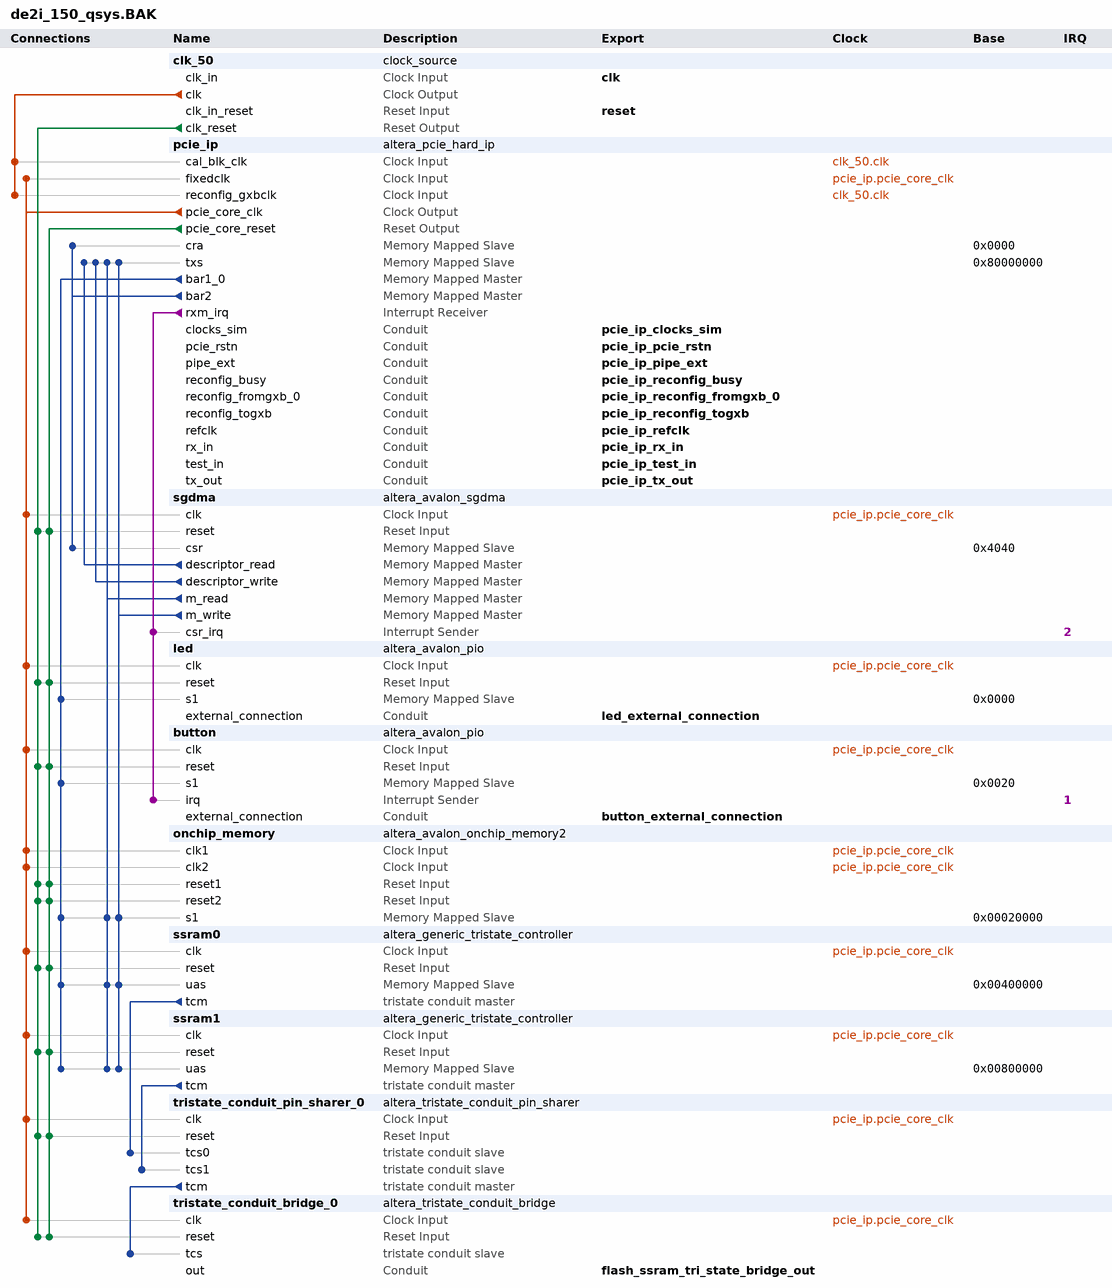
[diagram p0: system contents]
# Platform Designer (Qsys) system de2i_150_qsys.BAK, Cyclone IV GX EP4CGX150DF31C7
# Parameters at their usual value, and those the tool derives, are not listed.
package require -exact qsys 13.1
create_system de2i_150_qsys.BAK
set_project_property DEVICE_FAMILY {Cyclone IV GX}
set_project_property DEVICE EP4CGX150DF31C7

add_instance clk_50 clock_source 13.1
set_instance_parameter_value clk_50 clockFrequency 50000000

add_instance pcie_ip altera_pcie_hard_ip 13.1
set_instance_parameter_value pcie_ip p_pcie_test_out_width None
set_instance_parameter_value pcie_ip {BAR Type} {64 bit Prefetchable,Not used,32 bit Non-Prefetchable,Not used,Not used,Not used}
set_instance_parameter_value pcie_ip vendor_id 4466
set_instance_parameter_value pcie_ip device_id 57345
set_instance_parameter_value pcie_ip class_code 0
set_instance_parameter_value pcie_ip subsystem_vendor_id 4466
set_instance_parameter_value pcie_ip subsystem_device_id 4
set_instance_parameter_value pcie_ip my_advanced_errors false
set_instance_parameter_value pcie_ip my_enable_ecrc_check false
set_instance_parameter_value pcie_ip my_enable_ecrc_gen false
set_instance_parameter_value pcie_ip CG_NO_CPL_REORDERING 0
set_instance_parameter_value pcie_ip CG_ENABLE_A2P_INTERRUPT 0
set_instance_parameter_value pcie_ip p_user_msi_enable 0
set_instance_parameter_value pcie_ip CB_A2P_ADDR_MAP_PASS_THRU_BITS 31
set_instance_parameter_value pcie_ip {PCIe Address 63:32} 0x00000000,0x00000000,0x00000000,0x00000000,0x00000000,0x00000000,0x00000000,0x00000000,0x00000000,0x00000000,0x00000000,0x00000000,0x00000000,0x00000000,0x00000000,0x00000000
set_instance_parameter_value pcie_ip {PCIe Address 31:0} 0x00000000,0x00000000,0x00000000,0x00000000,0x00000000,0x00000000,0x00000000,0x00000000,0x00000000,0x00000000,0x00000000,0x00000000,0x00000000,0x00000000,0x00000000,0x00000000

add_instance sgdma altera_avalon_sgdma 13.1
set_instance_parameter_value sgdma enableBurstTransfers false
set_instance_parameter_value sgdma enableUnalignedTransfers false
set_instance_parameter_value sgdma readBlockDataWidth 64
set_instance_parameter_value sgdma sinkErrorWidth 0
set_instance_parameter_value sgdma sourceErrorWidth 0
set_instance_parameter_value sgdma transferMode MEMORY_TO_MEMORY
set_instance_parameter_value sgdma writeBurstcountWidth 4

add_instance led altera_avalon_pio 13.1
set_instance_parameter_value led direction Output
set_instance_parameter_value led width 4

add_instance button altera_avalon_pio 13.1
set_instance_parameter_value button captureEdge true
set_instance_parameter_value button direction Input
set_instance_parameter_value button edgeType FALLING
set_instance_parameter_value button generateIRQ true
set_instance_parameter_value button irqType EDGE
set_instance_parameter_value button width 4

add_instance onchip_memory altera_avalon_onchip_memory2 13.1
set_instance_parameter_value onchip_memory dataWidth 64
set_instance_parameter_value onchip_memory dualPort true
set_instance_parameter_value onchip_memory initMemContent true
set_instance_parameter_value onchip_memory initializationFileName onchip_memory
set_instance_parameter_value onchip_memory memorySize 131072

add_instance ssram0 altera_generic_tristate_controller 13.1
set_instance_parameter_value ssram0 TCM_ADDRESS_W 22
set_instance_parameter_value ssram0 TCM_DATA_W 32
set_instance_parameter_value ssram0 TCM_BYTEENABLE_W 4
set_instance_parameter_value ssram0 TCM_READ_WAIT 0
set_instance_parameter_value ssram0 TCM_WRITE_WAIT 0
set_instance_parameter_value ssram0 TCM_SETUP_WAIT 0
set_instance_parameter_value ssram0 TCM_DATA_HOLD 0
set_instance_parameter_value ssram0 TCM_MAX_PENDING_READ_TRANSACTIONS 5
set_instance_parameter_value ssram0 TCM_TURNAROUND_TIME 2
set_instance_parameter_value ssram0 TCM_TIMING_UNITS 1
set_instance_parameter_value ssram0 TCM_READLATENCY 4
set_instance_parameter_value ssram0 TCM_SYMBOLS_PER_WORD 4
set_instance_parameter_value ssram0 USE_READ 0
set_instance_parameter_value ssram0 USE_BEGINTRANSFER 1
set_instance_parameter_value ssram0 USE_BYTEENABLE 1
set_instance_parameter_value ssram0 USE_OUTPUTENABLE 1
set_instance_parameter_value ssram0 ACTIVE_LOW_READ 0
set_instance_parameter_value ssram0 ACTIVE_LOW_BYTEENABLE 1
set_instance_parameter_value ssram0 ACTIVE_LOW_OUTPUTENABLE 1
set_instance_parameter_value ssram0 ACTIVE_LOW_BEGINTRANSFER 1
set_instance_parameter_value ssram0 CHIPSELECT_THROUGH_READLATENCY 1
set_instance_parameter_value ssram0 MODULE_ASSIGNMENT_KEYS embeddedsw.configuration.hwClassnameDriverSupportList,embeddedsw.CMacro.SRAM_MEMORY_SIZE,embeddedsw.CMacro.SRAM_MEMORY_UNITS,embeddedsw.CMacro.SSRAM_DATA_WIDTH,embeddedsw.CMacro.SSRAM_READ_LATENCY,embeddedsw.memoryInfo.MEM_INIT_DATA_WIDTH,embeddedsw.memoryInfo.HAS_BYTE_LANE,embeddedsw.memoryInfo.GENERATE_DAT_SYM,embeddedsw.memoryInfo.DAT_SYM_INSTALL_DIR
set_instance_parameter_value ssram0 MODULE_ASSIGNMENT_VALUES altera_avalon_lan91c111:altera_avalon_cfi_flash,2,4194304,32,2,32,1,1,SIM_DIR
set_instance_parameter_value ssram0 INTERFACE_ASSIGNMENT_KEYS embeddedsw.configuration.isMemoryDevice
set_instance_parameter_value ssram0 INTERFACE_ASSIGNMENT_VALUES 1

add_instance ssram1 altera_generic_tristate_controller 13.1
set_instance_parameter_value ssram1 TCM_ADDRESS_W 22
set_instance_parameter_value ssram1 TCM_DATA_W 32
set_instance_parameter_value ssram1 TCM_BYTEENABLE_W 4
set_instance_parameter_value ssram1 TCM_READ_WAIT 0
set_instance_parameter_value ssram1 TCM_WRITE_WAIT 0
set_instance_parameter_value ssram1 TCM_SETUP_WAIT 0
set_instance_parameter_value ssram1 TCM_DATA_HOLD 0
set_instance_parameter_value ssram1 TCM_MAX_PENDING_READ_TRANSACTIONS 5
set_instance_parameter_value ssram1 TCM_TURNAROUND_TIME 2
set_instance_parameter_value ssram1 TCM_TIMING_UNITS 1
set_instance_parameter_value ssram1 TCM_READLATENCY 4
set_instance_parameter_value ssram1 TCM_SYMBOLS_PER_WORD 4
set_instance_parameter_value ssram1 USE_READ 0
set_instance_parameter_value ssram1 USE_BEGINTRANSFER 1
set_instance_parameter_value ssram1 USE_BYTEENABLE 1
set_instance_parameter_value ssram1 USE_OUTPUTENABLE 1
set_instance_parameter_value ssram1 ACTIVE_LOW_READ 0
set_instance_parameter_value ssram1 ACTIVE_LOW_BYTEENABLE 1
set_instance_parameter_value ssram1 ACTIVE_LOW_OUTPUTENABLE 1
set_instance_parameter_value ssram1 ACTIVE_LOW_BEGINTRANSFER 1
set_instance_parameter_value ssram1 CHIPSELECT_THROUGH_READLATENCY 1
set_instance_parameter_value ssram1 MODULE_ASSIGNMENT_KEYS embeddedsw.configuration.hwClassnameDriverSupportList,embeddedsw.CMacro.SRAM_MEMORY_SIZE,embeddedsw.CMacro.SRAM_MEMORY_UNITS,embeddedsw.CMacro.SSRAM_DATA_WIDTH,embeddedsw.CMacro.SSRAM_READ_LATENCY,embeddedsw.memoryInfo.MEM_INIT_DATA_WIDTH,embeddedsw.memoryInfo.HAS_BYTE_LANE,embeddedsw.memoryInfo.GENERATE_DAT_SYM,embeddedsw.memoryInfo.DAT_SYM_INSTALL_DIR
set_instance_parameter_value ssram1 MODULE_ASSIGNMENT_VALUES altera_avalon_lan91c111:altera_avalon_cfi_flash,2,4194304,32,2,32,1,1,SIM_DIR
set_instance_parameter_value ssram1 INTERFACE_ASSIGNMENT_KEYS embeddedsw.configuration.isMemoryDevice
set_instance_parameter_value ssram1 INTERFACE_ASSIGNMENT_VALUES 1

add_instance tristate_conduit_pin_sharer_0 altera_tristate_conduit_pin_sharer 13.1
set_instance_parameter_value tristate_conduit_pin_sharer_0 NUM_INTERFACES 2
set_instance_parameter_value tristate_conduit_pin_sharer_0 MODULE_ORIGIN_LIST ssram1.tcm,ssram1.tcm,ssram1.tcm,ssram1.tcm,ssram1.tcm,ssram1.tcm,ssram1.tcm,ssram0.tcm,ssram0.tcm,ssram0.tcm,ssram0.tcm,ssram0.tcm,ssram0.tcm,ssram0.tcm
set_instance_parameter_value tristate_conduit_pin_sharer_0 SIGNAL_ORIGIN_LIST address,outputenable_n,byteenable_n,begintransfer_n,write_n,data,chipselect_n,address,outputenable_n,byteenable_n,begintransfer_n,write_n,data,chipselect_n
set_instance_parameter_value tristate_conduit_pin_sharer_0 SHARED_SIGNAL_LIST fs_addr,ssram_oe_n,ssram_be_n,ssram_adsc_n,ssram_we_n,fs_data,ssram1_cs_n,fs_addr,ssram_oe_n,ssram_be_n,ssram_adsc_n,ssram_we_n,fs_data,ssram0_cs_n

add_instance tristate_conduit_bridge_0 altera_tristate_conduit_bridge 13.1

# connections
add_connection clk_50.clk pcie_ip.cal_blk_clk clock
add_connection clk_50.clk pcie_ip.reconfig_gxbclk clock
add_connection pcie_ip.pcie_core_clk button.clk clock
add_connection pcie_ip.pcie_core_clk led.clk clock
add_connection pcie_ip.pcie_core_clk onchip_memory.clk1 clock
add_connection pcie_ip.pcie_core_clk onchip_memory.clk2 clock
add_connection pcie_ip.pcie_core_clk pcie_ip.fixedclk clock
add_connection pcie_ip.pcie_core_clk sgdma.clk clock
add_connection pcie_ip.pcie_core_clk ssram0.clk clock
add_connection pcie_ip.pcie_core_clk ssram1.clk clock
add_connection pcie_ip.pcie_core_clk tristate_conduit_bridge_0.clk clock
add_connection pcie_ip.pcie_core_clk tristate_conduit_pin_sharer_0.clk clock
add_connection clk_50.clk_reset button.reset reset
add_connection clk_50.clk_reset led.reset reset
add_connection clk_50.clk_reset onchip_memory.reset1 reset
add_connection clk_50.clk_reset onchip_memory.reset2 reset
add_connection clk_50.clk_reset sgdma.reset reset
add_connection clk_50.clk_reset ssram0.reset reset
add_connection clk_50.clk_reset ssram1.reset reset
add_connection clk_50.clk_reset tristate_conduit_bridge_0.reset reset
add_connection clk_50.clk_reset tristate_conduit_pin_sharer_0.reset reset
add_connection pcie_ip.pcie_core_reset button.reset reset
add_connection pcie_ip.pcie_core_reset led.reset reset
add_connection pcie_ip.pcie_core_reset onchip_memory.reset1 reset
add_connection pcie_ip.pcie_core_reset onchip_memory.reset2 reset
add_connection pcie_ip.pcie_core_reset sgdma.reset reset
add_connection pcie_ip.pcie_core_reset ssram0.reset reset
add_connection pcie_ip.pcie_core_reset ssram1.reset reset
add_connection pcie_ip.pcie_core_reset tristate_conduit_bridge_0.reset reset
add_connection pcie_ip.pcie_core_reset tristate_conduit_pin_sharer_0.reset reset
add_connection pcie_ip.bar1_0 button.s1 avalon
set_connection_parameter_value pcie_ip.bar1_0/button.s1 baseAddress 0x0020
add_connection pcie_ip.bar1_0 led.s1 avalon
set_connection_parameter_value pcie_ip.bar1_0/led.s1 baseAddress 0x0000
add_connection pcie_ip.bar1_0 onchip_memory.s1 avalon
set_connection_parameter_value pcie_ip.bar1_0/onchip_memory.s1 baseAddress 0x00020000
add_connection pcie_ip.bar1_0 ssram0.uas avalon
set_connection_parameter_value pcie_ip.bar1_0/ssram0.uas baseAddress 0x00400000
add_connection pcie_ip.bar1_0 ssram1.uas avalon
set_connection_parameter_value pcie_ip.bar1_0/ssram1.uas baseAddress 0x00800000
add_connection pcie_ip.bar2 pcie_ip.cra avalon
set_connection_parameter_value pcie_ip.bar2/pcie_ip.cra baseAddress 0x0000
add_connection pcie_ip.bar2 sgdma.csr avalon
set_connection_parameter_value pcie_ip.bar2/sgdma.csr baseAddress 0x4040
add_connection sgdma.descriptor_read pcie_ip.txs avalon
set_connection_parameter_value sgdma.descriptor_read/pcie_ip.txs baseAddress 0x80000000
add_connection sgdma.descriptor_write pcie_ip.txs avalon
set_connection_parameter_value sgdma.descriptor_write/pcie_ip.txs baseAddress 0x80000000
add_connection sgdma.m_read onchip_memory.s1 avalon
set_connection_parameter_value sgdma.m_read/onchip_memory.s1 baseAddress 0x00020000
add_connection sgdma.m_read pcie_ip.txs avalon
set_connection_parameter_value sgdma.m_read/pcie_ip.txs baseAddress 0x80000000
add_connection sgdma.m_read ssram0.uas avalon
set_connection_parameter_value sgdma.m_read/ssram0.uas baseAddress 0x00400000
add_connection sgdma.m_read ssram1.uas avalon
set_connection_parameter_value sgdma.m_read/ssram1.uas baseAddress 0x00800000
add_connection sgdma.m_write onchip_memory.s1 avalon
set_connection_parameter_value sgdma.m_write/onchip_memory.s1 baseAddress 0x00020000
add_connection sgdma.m_write pcie_ip.txs avalon
set_connection_parameter_value sgdma.m_write/pcie_ip.txs baseAddress 0x80000000
add_connection sgdma.m_write ssram0.uas avalon
set_connection_parameter_value sgdma.m_write/ssram0.uas baseAddress 0x00400000
add_connection sgdma.m_write ssram1.uas avalon
set_connection_parameter_value sgdma.m_write/ssram1.uas baseAddress 0x00800000
add_connection pcie_ip.rxm_irq button.irq interrupt
set_connection_parameter_value pcie_ip.rxm_irq/button.irq irqNumber 1
add_connection pcie_ip.rxm_irq sgdma.csr_irq interrupt
set_connection_parameter_value pcie_ip.rxm_irq/sgdma.csr_irq irqNumber 2
add_connection ssram0.tcm tristate_conduit_pin_sharer_0.tcs0 tristate_conduit
add_connection ssram1.tcm tristate_conduit_pin_sharer_0.tcs1 tristate_conduit
add_connection tristate_conduit_pin_sharer_0.tcm tristate_conduit_bridge_0.tcs tristate_conduit

# exported interfaces
add_interface clk clock sink
set_interface_property clk EXPORT_OF clk_50.clk_in
add_interface reset reset sink
set_interface_property reset EXPORT_OF clk_50.clk_in_reset
add_interface pcie_ip_reconfig_togxb conduit end
set_interface_property pcie_ip_reconfig_togxb EXPORT_OF pcie_ip.reconfig_togxb
add_interface pcie_ip_refclk conduit end
set_interface_property pcie_ip_refclk EXPORT_OF pcie_ip.refclk
add_interface pcie_ip_test_in conduit end
set_interface_property pcie_ip_test_in EXPORT_OF pcie_ip.test_in
add_interface pcie_ip_pcie_rstn conduit end
set_interface_property pcie_ip_pcie_rstn EXPORT_OF pcie_ip.pcie_rstn
add_interface pcie_ip_clocks_sim conduit end
set_interface_property pcie_ip_clocks_sim EXPORT_OF pcie_ip.clocks_sim
add_interface pcie_ip_reconfig_busy conduit end
set_interface_property pcie_ip_reconfig_busy EXPORT_OF pcie_ip.reconfig_busy
add_interface pcie_ip_pipe_ext conduit end
set_interface_property pcie_ip_pipe_ext EXPORT_OF pcie_ip.pipe_ext
add_interface pcie_ip_rx_in conduit end
set_interface_property pcie_ip_rx_in EXPORT_OF pcie_ip.rx_in
add_interface pcie_ip_tx_out conduit end
set_interface_property pcie_ip_tx_out EXPORT_OF pcie_ip.tx_out
add_interface pcie_ip_reconfig_fromgxb_0 conduit end
set_interface_property pcie_ip_reconfig_fromgxb_0 EXPORT_OF pcie_ip.reconfig_fromgxb_0
add_interface led_external_connection conduit end
set_interface_property led_external_connection EXPORT_OF led.external_connection
add_interface button_external_connection conduit end
set_interface_property button_external_connection EXPORT_OF button.external_connection
add_interface flash_ssram_tri_state_bridge_out conduit end
set_interface_property flash_ssram_tri_state_bridge_out EXPORT_OF tristate_conduit_bridge_0.out

set_interconnect_requirement {$system} qsys_mm.clockCrossingAdapter HANDSHAKE
set_interconnect_requirement {$system} qsys_mm.maxAdditionalLatency 1

save_system de2i_150_qsys.BAK.qsys
